# EAGLE design buoyancy-engine-connector-male (EAGLE 8.2.2)
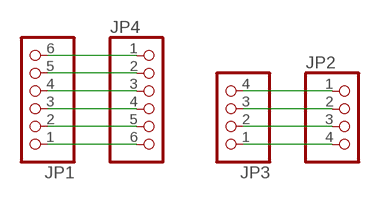
[diagram p0: schematic, sheet 1]

## Parts
JP1  PINHD-1X6  [1X06]
JP2  PINHD-1X4  [1X04]
JP3  PINHD-1X4  [1X04]
JP4  PINHD-1X6  [1X06]

## Nets
N$2: JP2.1 JP3.4
N$3: JP2.2 JP3.3
N$4: JP2.3 JP3.2
N$5: JP2.4 JP3.1
N$6: JP1.6 JP4.1
N$7: JP1.5 JP4.2
N$8: JP1.4 JP4.3
N$9: JP1.3 JP4.4
N$10: JP1.2 JP4.5
N$11: JP1.1 JP4.6

## Library data of the parts
JP1 JP4 = pinhead:PINHD-1X6: PIN HEADER
JP2 JP3 = pinhead:PINHD-1X4: PIN HEADER

## Board
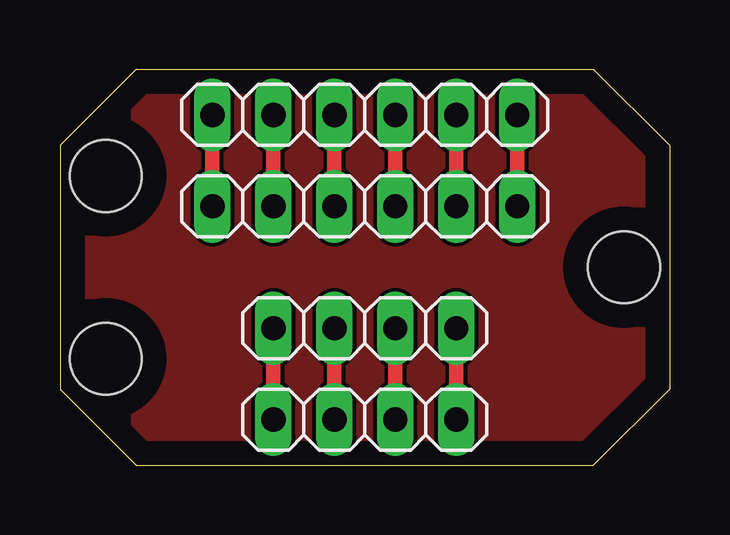
[diagram p1: board, top side]
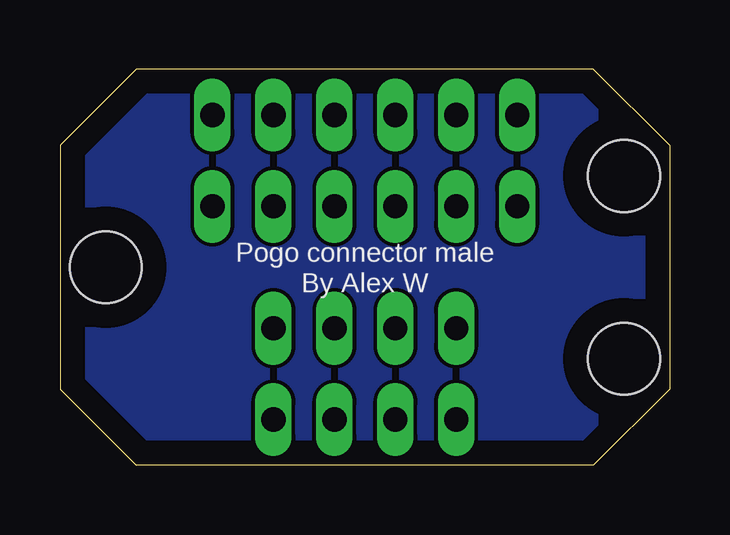
[diagram p2: board, bottom side, seen from below]

Size 25.4 x 16.51 mm. Coordinates in mm from the lower left corner, seen from the top.
Outline: 3.17,16.51 22.22,16.51 25.4,13.34 25.4,3.17 22.22,0 3.17,0 0,3.17 0,13.34 3.17,16.51
Copper layers (1*16): Top 0.035mm / dielectric 1.5mm / Bottom 0.035mm
Design rules "default": minimum track width 6mil, minimum drill 0.35mm, track to track 6mil, track to pad 6mil, pad to pad 6mil, via to via 6mil, smd to smd 6mil, copper to edge 40mil, drill to drill 6mil, minimum pad ring 10mil, minimum via ring 8mil, stop-mask expansion 4mil, vias tented up to drill 0mil, thermal gap 10mil
Holes 3 mm at 1.91,12.06 23.49,8.26 1.91,4.45

### Footprints (pad centres in the part's own frame; a part is rotated, then mirrored left to right if it is on the bottom)
1X06 = drill 1.016 long: 1 -6.35,0; 2 -3.81,0; 3 -1.27,0; 4 1.27,0; 5 3.81,0; 6 6.35,0
1X04 = drill 1.016 long: 1 -3.81,0; 2 -1.27,0; 3 1.27,0; 4 3.81,0

### Placement (x,y rotation side)
JP1  12.7,10.79 180 top
JP2  12.7,5.71 180 top
JP3  12.7,1.91 0 top
JP4  12.7,14.61 0 top

### Tracks (layer width: path | path; a pad name or v marks a point on that pad's centre or on a via)
N$1
  pour Top: 0,13.34 3.17,16.51 22.22,16.51 25.4,13.34 25.4,3.17 22.22,0 3.17,0 0,3.17
N$2
  Top 0.61: JP2.1 JP3.4
N$3
  Top 0.61: JP2.2 JP3.3
N$4
  Top 0.61: JP2.3 JP3.2
N$5
  Top 0.61: JP2.4 JP3.1
N$6
  Top 0.61: JP4.1 JP1.6
N$7
  Top 0.61: JP4.2 JP1.5
N$8
  Top 0.61: JP4.3 JP1.4
N$9
  Top 0.61: JP4.4 JP1.3
N$10
  Top 0.61: JP4.5 JP1.2
N$11
  Top 0.61: JP4.6 JP1.1
N$12
  pour Bottom: 0,13.34 3.17,16.51 22.22,16.51 25.4,13.34 25.4,3.17 22.22,0 3.17,0 0,3.17

### Text on the board
bNames: Pogo connector male | By Alex W